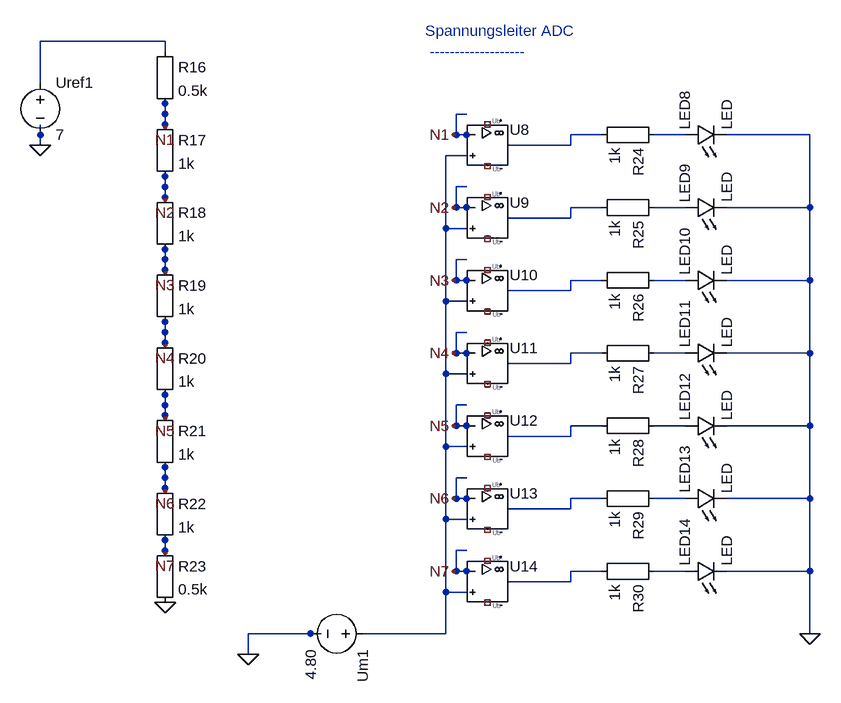
[diagram p0: schematic 8_2_1_Parallel_Wandler_Prinzip.asc]
8_2_1_Parallel_Wandler_Prinzip.asc, the LTspice schematic file:
Version 4
SHEET 1 880 680
WIRE 928 208 912 208
WIRE 912 208 912 176
WIRE 912 176 928 176
WIRE 992 224 1088 224
WIRE 1088 224 1088 208
WIRE 928 320 912 320
WIRE 912 320 912 288
WIRE 912 288 928 288
WIRE 992 336 1088 336
WIRE 1088 336 1088 320
WIRE 928 432 912 432
WIRE 912 432 912 400
WIRE 912 400 928 400
WIRE 992 448 1088 448
WIRE 1088 448 1088 432
WIRE 928 544 912 544
WIRE 912 544 912 512
WIRE 912 512 928 512
WIRE 992 560 1088 560
WIRE 1088 560 1088 544
WIRE 928 656 912 656
WIRE 912 656 912 624
WIRE 912 624 928 624
WIRE 992 672 1088 672
WIRE 1088 672 1088 656
WIRE 928 768 912 768
WIRE 912 768 912 736
WIRE 912 736 928 736
WIRE 992 784 1088 784
WIRE 1088 784 1088 768
WIRE 928 880 912 880
WIRE 912 880 912 848
WIRE 912 848 928 848
WIRE 992 896 1088 896
WIRE 1088 896 1088 880
WIRE 688 976 704 976
WIRE 1328 208 1360 208
WIRE 1328 320 1360 320
WIRE 1328 432 1360 432
WIRE 1328 544 1360 544
WIRE 1328 656 1360 656
WIRE 1328 768 1360 768
WIRE 1328 880 1360 880
WIRE 272 208 272 192
WIRE 464 160 464 176
WIRE 464 272 464 288
WIRE 464 384 464 400
WIRE 464 608 464 624
WIRE 464 720 464 736
WIRE 464 832 464 848
WIRE 704 976 592 976
WIRE 592 976 592 1008
WIRE 1088 208 1136 208
WIRE 1088 320 1136 320
WIRE 1088 432 1136 432
WIRE 1088 544 1136 544
WIRE 1088 656 1136 656
WIRE 1088 768 1136 768
WIRE 1088 880 1136 880
WIRE 1360 880 1456 880
WIRE 272 192 272 224
WIRE 1216 208 1264 208
WIRE 1216 320 1264 320
WIRE 1216 432 1264 432
WIRE 1216 544 1264 544
WIRE 1216 656 1264 656
WIRE 1216 768 1264 768
WIRE 1216 880 1264 880
WIRE 1456 880 1456 976
WIRE 1360 208 1456 208
WIRE 1456 208 1456 320
WIRE 1456 320 1456 432
WIRE 1360 320 1456 320
WIRE 1456 432 1456 544
WIRE 1360 432 1456 432
WIRE 1456 544 1456 656
WIRE 1360 544 1456 544
WIRE 1456 656 1456 768
WIRE 1360 656 1456 656
WIRE 1456 768 1456 880
WIRE 1360 768 1456 768
WIRE 464 176 464 192
WIRE 464 288 464 304
WIRE 464 400 464 416
WIRE 464 496 464 512
WIRE 464 512 464 528
WIRE 464 624 464 640
WIRE 464 736 464 752
WIRE 928 240 896 240
WIRE 896 240 896 352
WIRE 896 352 896 464
WIRE 928 352 896 352
WIRE 896 464 896 576
WIRE 928 464 896 464
WIRE 896 576 896 688
WIRE 928 576 896 576
WIRE 896 688 896 800
WIRE 928 688 896 688
WIRE 896 800 896 912
WIRE 928 800 896 800
WIRE 896 912 896 976
WIRE 896 976 768 976
WIRE 928 912 896 912
WIRE 464 80 464 64
WIRE 464 64 272 64
WIRE 272 64 272 128
WIRE 464 160 464 196
WIRE 928 208 908 208
WIRE 464 272 464 308
WIRE 928 320 908 320
WIRE 464 384 464 420
WIRE 928 432 908 432
WIRE 464 496 464 532
WIRE 928 544 908 544
WIRE 464 608 464 644
WIRE 928 656 908 656
WIRE 464 720 464 756
WIRE 928 768 908 768
WIRE 464 832 464 852
WIRE 928 880 908 880
FLAG 464 928 0
FLAG 592 1008 0
FLAG 1456 976 0
FLAG 272 224 0
FLAG 464 196 N1
FLAG 908 208 N1
FLAG 464 308 N2
FLAG 908 320 N2
FLAG 464 420 N3
FLAG 908 432 N3
FLAG 464 532 N4
FLAG 908 544 N4
FLAG 464 644 N5
FLAG 908 656 N5
FLAG 464 756 N6
FLAG 908 768 N6
FLAG 464 852 N7
FLAG 908 880 N7
FLAG 1456 976 0
FLAG 464 928 0
FLAG 592 1008 0
FLAG 272 224 0
SYMBOL Misc\EuropeanResistor 448 64 R0
SYMATTR InstName R16
SYMATTR Value 0.5k
SYMBOL Misc\EuropeanResistor 448 176 R0
SYMATTR InstName R17
SYMATTR Value 1k
SYMBOL UniversalOpAmp2 960 224 R0
SYMATTR InstName U8
SYMATTR Value UniversalOpAmp2
SYMBOL Misc\EuropeanResistor 448 288 R0
SYMATTR InstName R18
SYMATTR Value 1k
SYMBOL UniversalOpAmp2 960 336 R0
SYMATTR InstName U9
SYMATTR Value UniversalOpAmp2
SYMBOL Misc\EuropeanResistor 448 400 R0
SYMATTR InstName R19
SYMATTR Value 1k
SYMBOL UniversalOpAmp2 960 448 R0
SYMATTR InstName U10
SYMATTR Value UniversalOpAmp2
SYMBOL Misc\EuropeanResistor 448 512 R0
SYMATTR InstName R20
SYMATTR Value 1k
SYMBOL UniversalOpAmp2 960 560 R0
SYMATTR InstName U11
SYMATTR Value UniversalOpAmp2
SYMBOL Misc\EuropeanResistor 448 624 R0
SYMATTR InstName R21
SYMATTR Value 1k
SYMBOL UniversalOpAmp2 960 672 R0
SYMATTR InstName U12
SYMATTR Value UniversalOpAmp2
SYMBOL Misc\EuropeanResistor 448 736 R0
SYMATTR InstName R22
SYMATTR Value 1k
SYMBOL UniversalOpAmp2 960 784 R0
SYMATTR InstName U13
SYMATTR Value UniversalOpAmp2
SYMBOL Misc\EuropeanResistor 448 832 R0
SYMATTR InstName R23
SYMATTR Value 0.5k
SYMBOL UniversalOpAmp2 960 896 R0
SYMATTR InstName U14
SYMATTR Value UniversalOpAmp2
SYMBOL voltage 784 976 R90
SYMATTR InstName Um1
SYMATTR Value 4.80
SYMBOL LED 1264 224 R270
SYMATTR InstName LED8
SYMATTR Value LED
SYMBOL LED 1264 336 R270
SYMATTR InstName LED9
SYMATTR Value LED
SYMBOL LED 1264 448 R270
SYMATTR InstName LED10
SYMATTR Value LED
SYMBOL LED 1264 560 R270
SYMATTR InstName LED11
SYMATTR Value LED
SYMBOL LED 1264 672 R270
SYMATTR InstName LED12
SYMATTR Value LED
SYMBOL LED 1264 784 R270
SYMATTR InstName LED13
SYMATTR Value LED
SYMBOL LED 1264 896 R270
SYMATTR InstName LED14
SYMATTR Value LED
SYMBOL voltage 272 112 R0
SYMATTR InstName Uref1
SYMATTR Value 7
SYMBOL Misc\EuropeanResistor 1232 192 R90
SYMATTR InstName R24
SYMATTR Value 1k
SYMBOL Misc\EuropeanResistor 1232 304 R90
SYMATTR InstName R25
SYMATTR Value 1k
SYMBOL Misc\EuropeanResistor 1232 416 R90
SYMATTR InstName R26
SYMATTR Value 1k
SYMBOL Misc\EuropeanResistor 1232 528 R90
SYMATTR InstName R27
SYMATTR Value 1k
SYMBOL Misc\EuropeanResistor 1232 640 R90
SYMATTR InstName R28
SYMATTR Value 1k
SYMBOL Misc\EuropeanResistor 1232 752 R90
SYMATTR InstName R29
SYMATTR Value 1k
SYMBOL Misc\EuropeanResistor 1232 864 R90
SYMATTR InstName R30
SYMATTR Value 1k
TEXT 864 48 Left 2 ;Spannungsleiter ADC \n -------------------

The netlist it stands for:
* 8_2_1_Parallel_Wandler_Prinzip.asc
R16 N016 N1 0.5k
R17 N1 N2 1k
XU8 N015 N1 NC_01 NC_02 N001 level2 UniversalOpAmp2 Avol=1Meg GBW=10Meg Slew=10Meg Ilimit=25m Rail=0 Vos=0 En=0 Enk=0 In=0 Ink=0 Rin=500Meg  ; pins In+ In- V+ V- OUT
R18 N2 N3 1k
XU9 N015 N2 NC_03 NC_04 N002 level2 UniversalOpAmp2 Avol=1Meg GBW=10Meg Slew=10Meg Ilimit=25m Rail=0 Vos=0 En=0 Enk=0 In=0 Ink=0 Rin=500Meg  ; pins In+ In- V+ V- OUT
R19 N3 N4 1k
XU10 N015 N3 NC_05 NC_06 N003 level2 UniversalOpAmp2 Avol=1Meg GBW=10Meg Slew=10Meg Ilimit=25m Rail=0 Vos=0 En=0 Enk=0 In=0 Ink=0 Rin=500Meg  ; pins In+ In- V+ V- OUT
R20 N4 N5 1k
XU11 N015 N4 NC_07 NC_08 N004 level2 UniversalOpAmp2 Avol=1Meg GBW=10Meg Slew=10Meg Ilimit=25m Rail=0 Vos=0 En=0 Enk=0 In=0 Ink=0 Rin=500Meg  ; pins In+ In- V+ V- OUT
R21 N5 N6 1k
XU12 N015 N5 NC_09 NC_10 N005 level2 UniversalOpAmp2 Avol=1Meg GBW=10Meg Slew=10Meg Ilimit=25m Rail=0 Vos=0 En=0 Enk=0 In=0 Ink=0 Rin=500Meg  ; pins In+ In- V+ V- OUT
R22 N6 N7 1k
XU13 N015 N6 NC_11 NC_12 N006 level2 UniversalOpAmp2 Avol=1Meg GBW=10Meg Slew=10Meg Ilimit=25m Rail=0 Vos=0 En=0 Enk=0 In=0 Ink=0 Rin=500Meg  ; pins In+ In- V+ V- OUT
R23 N7 0 0.5k
XU14 N015 N7 NC_13 NC_14 N007 level2 UniversalOpAmp2 Avol=1Meg GBW=10Meg Slew=10Meg Ilimit=25m Rail=0 Vos=0 En=0 Enk=0 In=0 Ink=0 Rin=500Meg  ; pins In+ In- V+ V- OUT
V§Um1 N015 0 4.80
D§LED8 N008 0 LED
D§LED9 N009 0 LED
D§LED10 N010 0 LED
D§LED11 N011 0 LED
D§LED12 N012 0 LED
D§LED13 N013 0 LED
D§LED14 N014 0 LED
V§Uref1 N016 0 7
R24 N008 N001 1k
R25 N009 N002 1k
R26 N010 N003 1k
R27 N011 N004 1k
R28 N012 N005 1k
R29 N013 N006 1k
R30 N014 N007 1k
.model D D
.lib standard.dio
* Spannungsleiter ADC
*  -------------------
.lib UniversalOpAmp2.lib
.backanno
.end